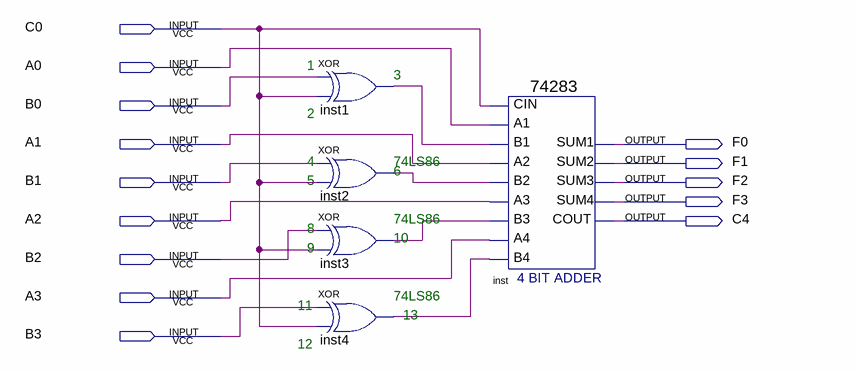
[diagram p0: schematic sheet]
// Quartus schematic LAB6PT2.bdf as structural Verilog: 5 symbols, 14 pins
module LAB6PT2 (
  input  C0,
  input  A0,
  input  B0,
  input  A1,
  input  B1,
  input  A2,
  input  B2,
  input  A3,
  input  B3,
  output F0,
  output F1,
  output F2,
  output F3,
  output C4
);

  wire inst1_out, inst2_out, inst3_out, inst4_out;

  xor inst1 (inst1_out, B0, C0);
  xor inst2 (inst2_out, B1, C0);
  xor inst3 (inst3_out, B2, C0);
  xor inst4 (inst4_out, B3, C0);
  \74283  inst (
    .CIN(C0), .A1(A0), .A2(A1), .B2(inst2_out), .A3(A2), .A4(A3), .B4(inst4_out), .B1(inst1_out),
    .B3(inst3_out), .SUM4(F3), .COUT(C4), .SUM1(F0), .SUM2(F1), .SUM3(F2));

  // Notes on the sheet:
  //   1
  //   3
  //   2
  //   4
  //   74LS86
  //   6
  //   5
  //   74LS86
  //   8
  //   10
  //   9
  //   74LS86
  //   11
  //   13
  //   12
endmodule
